# EAGLE design PWM LED Controller (EAGLE 9.6.2)
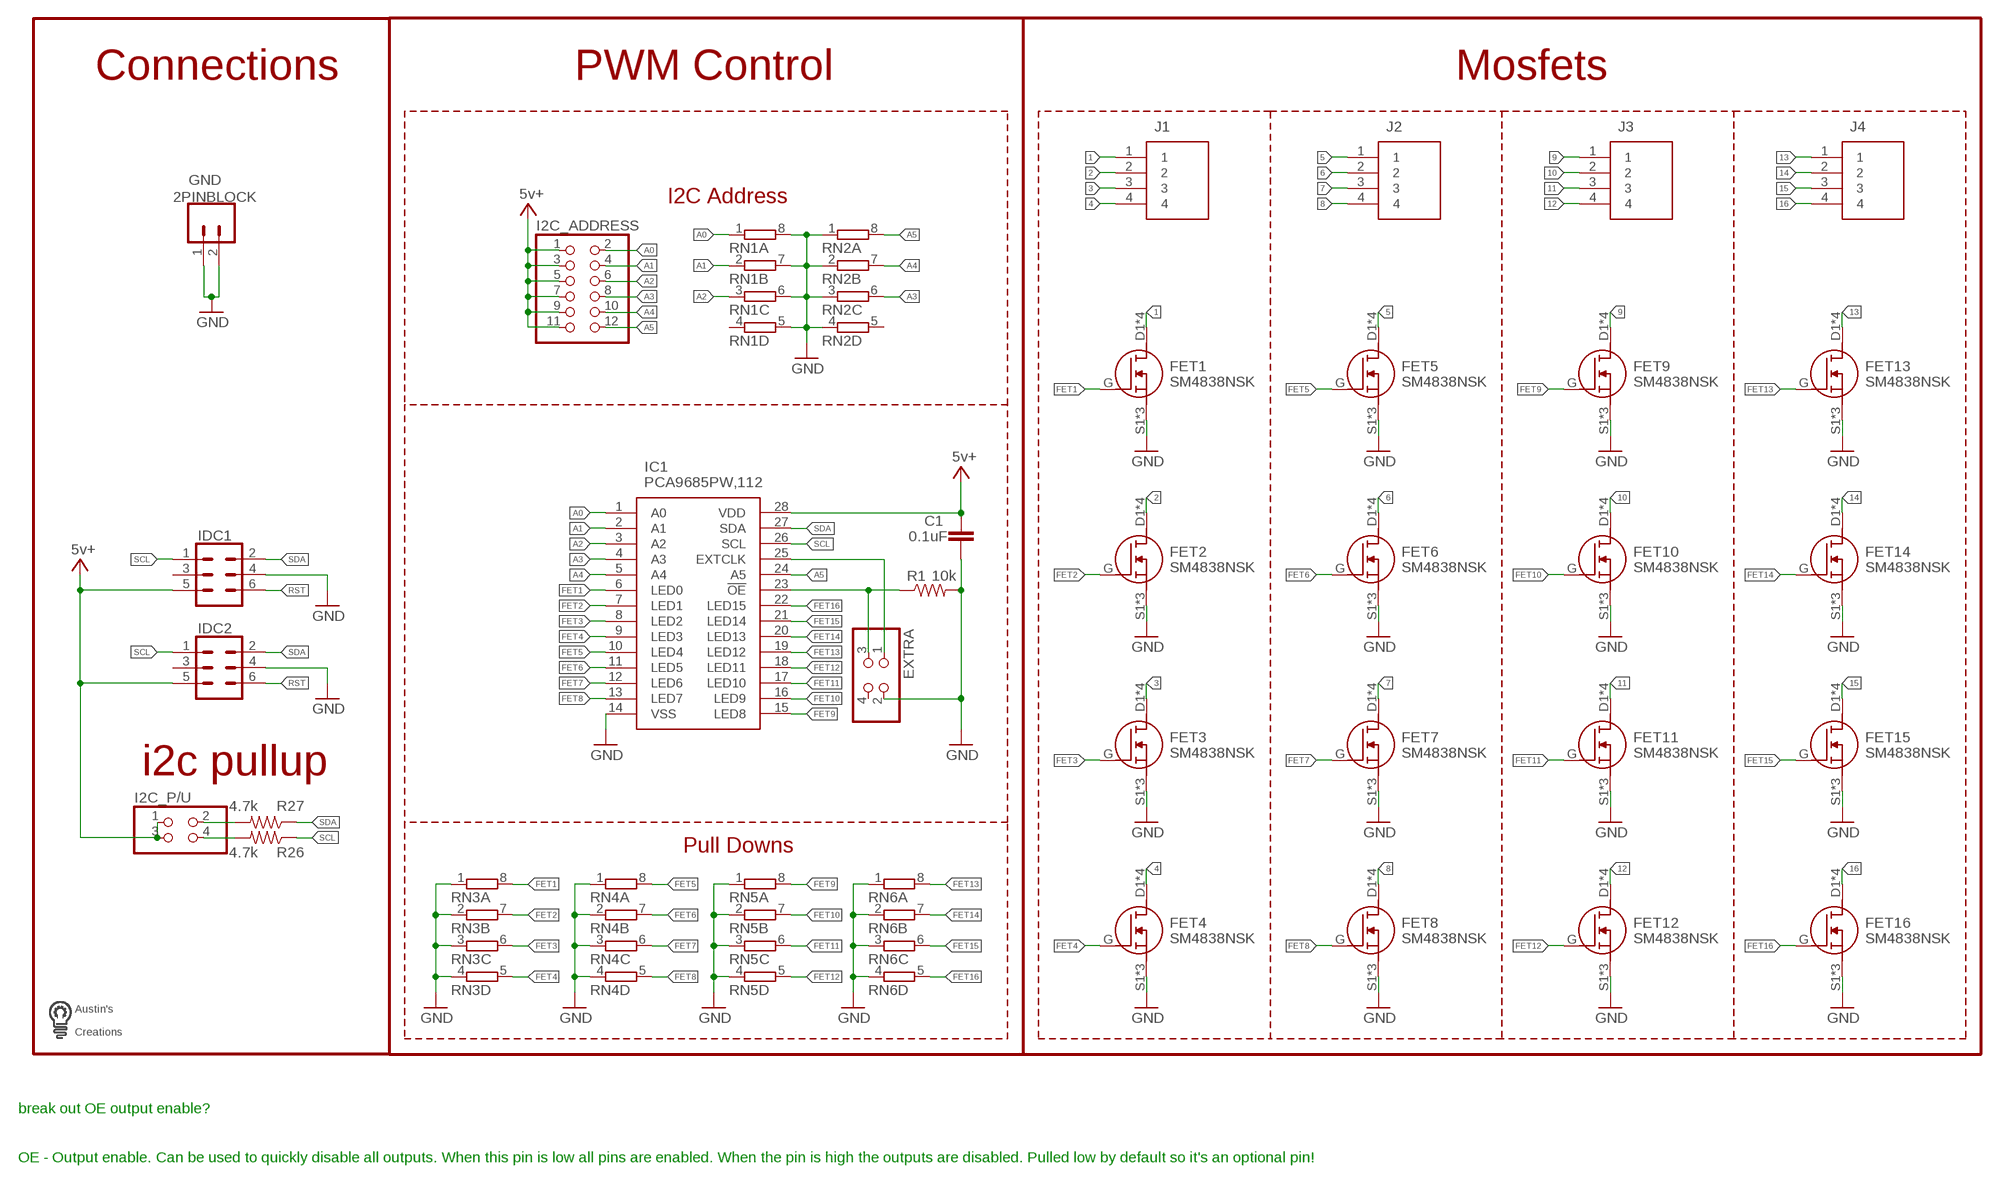
[diagram p0: schematic, sheet 1]

## Parts
C1  0.1uF  C-EUC0603  [C0603]
EXTRA  PINHD-2X2  [2X02]
FET1  SM4838NSK  [SM4838NSK]
FET2  SM4838NSK  [SM4838NSK]
FET3  SM4838NSK  [SM4838NSK]
FET4  SM4838NSK  [SM4838NSK]
FET5  SM4838NSK  [SM4838NSK]
FET6  SM4838NSK  [SM4838NSK]
FET7  SM4838NSK  [SM4838NSK]
FET8  SM4838NSK  [SM4838NSK]
FET9  SM4838NSK  [SM4838NSK]
FET10  SM4838NSK  [SM4838NSK]
FET11  SM4838NSK  [SM4838NSK]
FET12  SM4838NSK  [SM4838NSK]
FET13  SM4838NSK  [SM4838NSK]
FET14  SM4838NSK  [SM4838NSK]
FET15  SM4838NSK  [SM4838NSK]
FET16  SM4838NSK  [SM4838NSK]
GND  2PINBLOCK  [SCREWTERMINAL-5MM-2]
I2C_ADDRESS  PINHD-2X6  [2X06]
I2C_P/U  PINHD-2X2  [2X02]
IC1  PCA9685PW,112  [SOP65P640X110-28N]
IDC1  CONN_03X2SHROUD  [2X3-SHROUDED]
IDC2  CONN_03X2SHROUD  [2X3-SHROUDED]
J1  SCREWTERMINAL-4P-5MM  [SCREWTERMINAL-4P-5MM]
J2  SCREWTERMINAL-4P-5MM  [SCREWTERMINAL-4P-5MM]
J3  SCREWTERMINAL-4P-5MM  [SCREWTERMINAL-4P-5MM]
J4  SCREWTERMINAL-4P-5MM  [SCREWTERMINAL-4P-5MM]
R1  10k  R-US_R0603  [R0603]
R26  4.7k  R-US_R0603  [R0603]
R27  4.7k  R-US_R0603  [R0603]
RN1  4R-N0603-ARC  [0603-ARC]
RN2  4R-N0603-ARC  [0603-ARC]
RN3  4R-N0603-ARC  [0603-ARC]
RN4  4R-N0603-ARC  [0603-ARC]
RN5  4R-N0603-ARC  [0603-ARC]
RN6  4R-N0603-ARC  [0603-ARC]
U$1  LOGOMED  [LOGOMED]

## Nets
1: FET1.D1(D) FET1.D2(D) FET1.D3(D) FET1.D4(D) J1.1
2: FET2.D1(D) FET2.D2(D) FET2.D3(D) FET2.D4(D) J1.2
3: FET3.D1(D) FET3.D2(D) FET3.D3(D) FET3.D4(D) J1.3
4: FET4.D1(D) FET4.D2(D) FET4.D3(D) FET4.D4(D) J1.4
5: FET5.D1(D) FET5.D2(D) FET5.D3(D) FET5.D4(D) J2.1
6: FET6.D1(D) FET6.D2(D) FET6.D3(D) FET6.D4(D) J2.2
7: FET7.D1(D) FET7.D2(D) FET7.D3(D) FET7.D4(D) J2.3
8: FET8.D1(D) FET8.D2(D) FET8.D3(D) FET8.D4(D) J2.4
9: FET9.D1(D) FET9.D2(D) FET9.D3(D) FET9.D4(D) J3.1
10: FET10.D1(D) FET10.D2(D) FET10.D3(D) FET10.D4(D) J3.2
11: FET11.D1(D) FET11.D2(D) FET11.D3(D) FET11.D4(D) J3.3
12: FET12.D1(D) FET12.D2(D) FET12.D3(D) FET12.D4(D) J3.4
13: FET13.D1(D) FET13.D2(D) FET13.D3(D) FET13.D4(D) J4.1
14: FET14.D1(D) FET14.D2(D) FET14.D3(D) FET14.D4(D) J4.2
15: FET15.D1(D) FET15.D2(D) FET15.D3(D) FET15.D4(D) J4.3
16: FET16.D1(D) FET16.D2(D) FET16.D3(D) FET16.D4(D) J4.4
A0: I2C_ADDRESS.2 IC1.1(A0) RN1.1
A1: I2C_ADDRESS.4 IC1.2(A1) RN1.2
A2: I2C_ADDRESS.6 IC1.3(A2) RN1.3
A3: I2C_ADDRESS.8 IC1.4(A3) RN2.6
A4: I2C_ADDRESS.10 IC1.5(A4) RN2.7
A5: I2C_ADDRESS.12 IC1.24(A5) RN2.8
FET1: FET1.G IC1.6(LED0) RN3.8
FET2: FET2.G IC1.7(LED1) RN3.7
FET3: FET3.G IC1.8(LED2) RN3.6
FET4: FET4.G IC1.9(LED3) RN3.5
FET5: FET5.G IC1.10(LED4) RN4.8
FET6: FET6.G IC1.11(LED5) RN4.7
FET7: FET7.G IC1.12(LED6) RN4.6
FET8: FET8.G IC1.13(LED7) RN4.5
FET9: FET9.G IC1.15(LED8) RN5.8
FET10: FET10.G IC1.16(LED9) RN5.7
FET11: FET11.G IC1.17(LED10) RN5.6
FET12: FET12.G IC1.18(LED11) RN5.5
FET13: FET13.G IC1.19(LED12) RN6.8
FET14: FET14.G IC1.20(LED13) RN6.7
FET15: FET15.G IC1.21(LED14) RN6.6
FET16: FET16.G IC1.22(LED15) RN6.5
GND: C1.2 EXTRA.2 FET1.S1(S) FET1.S2(S) FET1.S3(S) FET2.S1(S) FET2.S2(S) FET2.S3(S) FET3.S1(S) FET3.S2(S) FET3.S3(S) FET4.S1(S) FET4.S2(S) FET4.S3(S) FET5.S1(S) FET5.S2(S) FET5.S3(S) FET6.S1(S) FET6.S2(S) FET6.S3(S) FET7.S1(S) FET7.S2(S) FET7.S3(S) FET8.S1(S) FET8.S2(S) FET8.S3(S) FET9.S1(S) FET9.S2(S) FET9.S3(S) FET10.S1(S) FET10.S2(S) FET10.S3(S) FET11.S1(S) FET11.S2(S) FET11.S3(S) FET12.S1(S) FET12.S2(S) FET12.S3(S) FET13.S1(S) FET13.S2(S) FET13.S3(S) FET14.S1(S) FET14.S2(S) FET14.S3(S) FET15.S1(S) FET15.S2(S) FET15.S3(S) FET16.S1(S) FET16.S2(S) FET16.S3(S) GND.1 GND.2 IC1.14(VSS) IDC1.4 IDC2.4 R1.2 RN1.5 RN1.6 RN1.7 RN1.8 RN2.1 RN2.2 RN2.3 RN2.4 RN3.1 RN3.2 RN3.3 RN3.4 RN4.1 RN4.2 RN4.3 RN4.4 RN5.1 RN5.2 RN5.3 RN5.4 RN6.1 RN6.2 RN6.3 RN6.4
N$1: I2C_P/U.4 R26.2
N$2: I2C_P/U.2 R27.2
N$3: EXTRA.1 IC1.25(EXTCLK)
N$4: EXTRA.3 IC1.23(!OE) R1.1
RST: IDC1.6 IDC2.6
SCL: IC1.26(SCL) IDC1.1 IDC2.1 R26.1
SDA: IC1.27(SDA) IDC1.2 IDC2.2 R27.1
VCC: C1.1 I2C_ADDRESS.1 I2C_ADDRESS.3 I2C_ADDRESS.5 I2C_ADDRESS.7 I2C_ADDRESS.9 I2C_ADDRESS.11 I2C_P/U.1 I2C_P/U.3 IC1.28(VDD) IDC1.5 IDC2.5 ; supply symbol labelled 5v+
Unconnected: EXTRA.4 IDC1.3 IDC2.3 RN1.4 RN2.5

## Notes on the sheet
- Connections | PWM Control | Mosfets
- I2C Address
- i2c pullup
- Pull Downs
- break out OE output enable?
  
  
  OE - Output enable. Can be used to quickly disable all outputs. When this pin is low all pins are enabled. When the pin is high the outputs are disabled. Pulled low by default so it's an optional pin!

## Library data of the parts
C1 = rcl:C-EU: CAPACITOR, European symbol; SPICEPREFIX: C
EXTRA I2C_P/U = pinhead:PINHD-2X2: PIN HEADER
FET1-FET16 = custom parts:SM4838NSK: N channel mosfet 30v 10a SOP-8
GND = custom parts:2PINBLOCK
I2C_ADDRESS = pinhead:PINHD-2X6: PIN HEADER
IC1 = SamacSys_Parts:PCA9685PW,112: 16-channel, 12-bit PWM Fm+ I2C-bus LED controller Source: Datasheet <http://www.nxp.com/docs/en/data-sheet/PCA9685.pdf>; ARROW_PART_NUMBER: PCA9685PW,112; ARROW_PRICE-STOCK: https://www.arrow.com/en/products/pca9685pw112/nxp-semiconductors; DESCRIPTION: 16-channel, 12-bit PWM Fm+ I2C-bus LED controller; HEIGHT: 1.1mm; MANUFACTURER_NAME: NXP; MANUFACTURER_PART_NUMBER: PCA9685PW,112; MOUSER_PART_NUMBER: 771-PCA9685PW,112; MOUSER_PRICE-STOCK: https://www.mouser.co.uk/ProductDetail/NXP-Semiconductors/PCA9685PW112?qs=6YAT8rHPFU9wZqiAeiOMZw%3D%3D
IDC1 IDC2 = custom parts:CONN_03X2: Multi connection point. Often used as Generic Header-pin footprint for 0.1 inch spaced/style header connections You can populate with any combo of single row headers, but if you'd like an exact match, check these: Header - 2x3 (Male, 0.1") <https://www.sparkfun.com/products/12807> (PRT-12807) Header - 2x3 (Female, 0.1") <https://www.sparkfun.com/products/13010> (PRT-13010) 2x3 Pin Shrouded Header <https://www.sparkfun.com/products/10877> (PRT-10877) On any of the 0.1 inch spaced packages, you can populate with these: Break Away Headers - Straight <https://www.sparkfun.com/products/116> (PRT-00116) Break Away Male Headers - Right Angle <https://www.sparkfun.com/products/553> (PRT-00553) Female Headers <https://www.sparkfun.com/products/115> (PRT-00115) Break Away Headers - Machine Pin <https://www.sparkfun.com/products/117> (PRT-00117) Break Away Female Headers - Swiss Machine Pin <https://www.sparkfun.com/products/743> (PRT-00743) Special note: the shrouded connector mates well with our 3x2 ribbon cables: Ribbon Crimp Connector - 6-pin (2x3, Female) <https://www.sparkfun.com/products/10651> (PRT-10651) Ribbon Cable - 6 wire (15ft) <https://www.sparkfun.com/products/10646> (PRT-10646); PROD_ID: CONN-10681; SF_ID: PRT_10877
J1-J4 = SamacSys_Parts:SCREWTERMINAL-4P-5MM: Fixed Terminal Blocks Terminal block, screw type, 5.00, horizontal, 4 poles, CUI Blue, slotted screw, PCB mount Source: Datasheet <https://componentsearchengine.com/Datasheets/1/TB001-500-04BE.pdf>; DESCRIPTION: Fixed Terminal Blocks Terminal block, screw type, 5.00, horizontal, 4 poles, CUI Blue, slotted screw, PCB mount; HEIGHT: 12.9mm; MANUFACTURER_NAME: CUI Inc.; MANUFACTURER_PART_NUMBER: TB001-500-04BE; MOUSER_PART_NUMBER: 490-TB001-500-04BE; MOUSER_PRICE-STOCK: https://www.mouser.co.uk/ProductDetail/CUI-Devices/TB001-500-04BE?qs=vLWxofP3U2xFd1xqNcHXZA%3D%3D
R1 R26 R27 = rcl:R-US_: RESISTOR, American symbol; SPICEPREFIX: R
RN1-RN6 = custom parts:4R-N: Array Chip Resistor Source: RS Component / Phycomp; OC_FARNELL: unknown; OC_NEWARK: unknown
U$1 = custom parts:LOGOMED

## Board
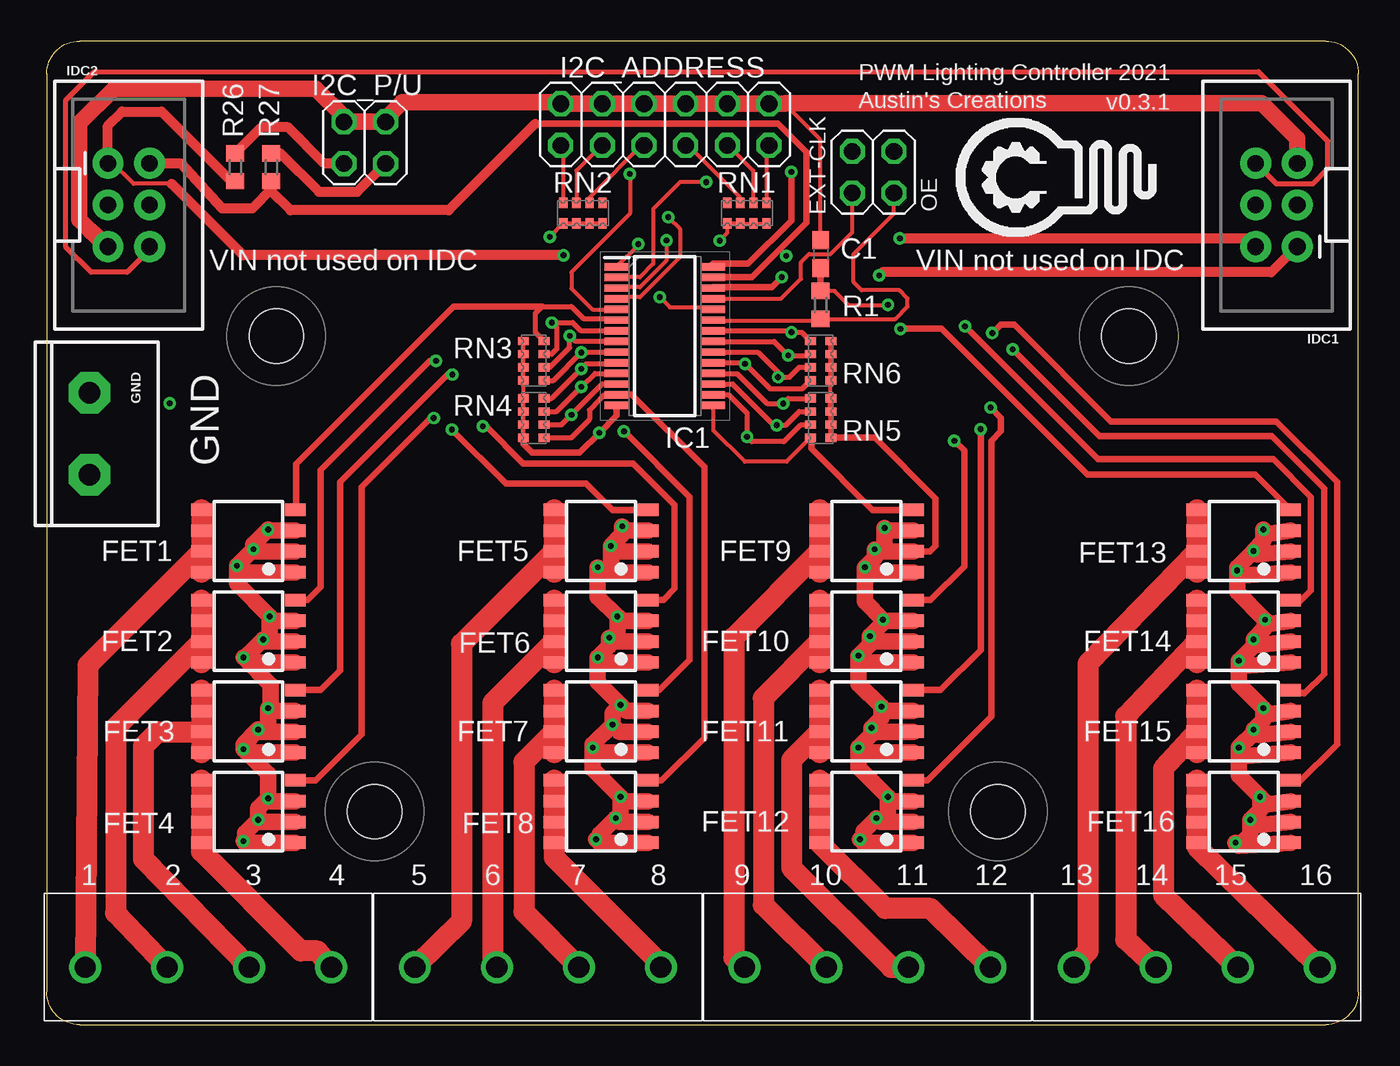
[diagram p1: board, top side]
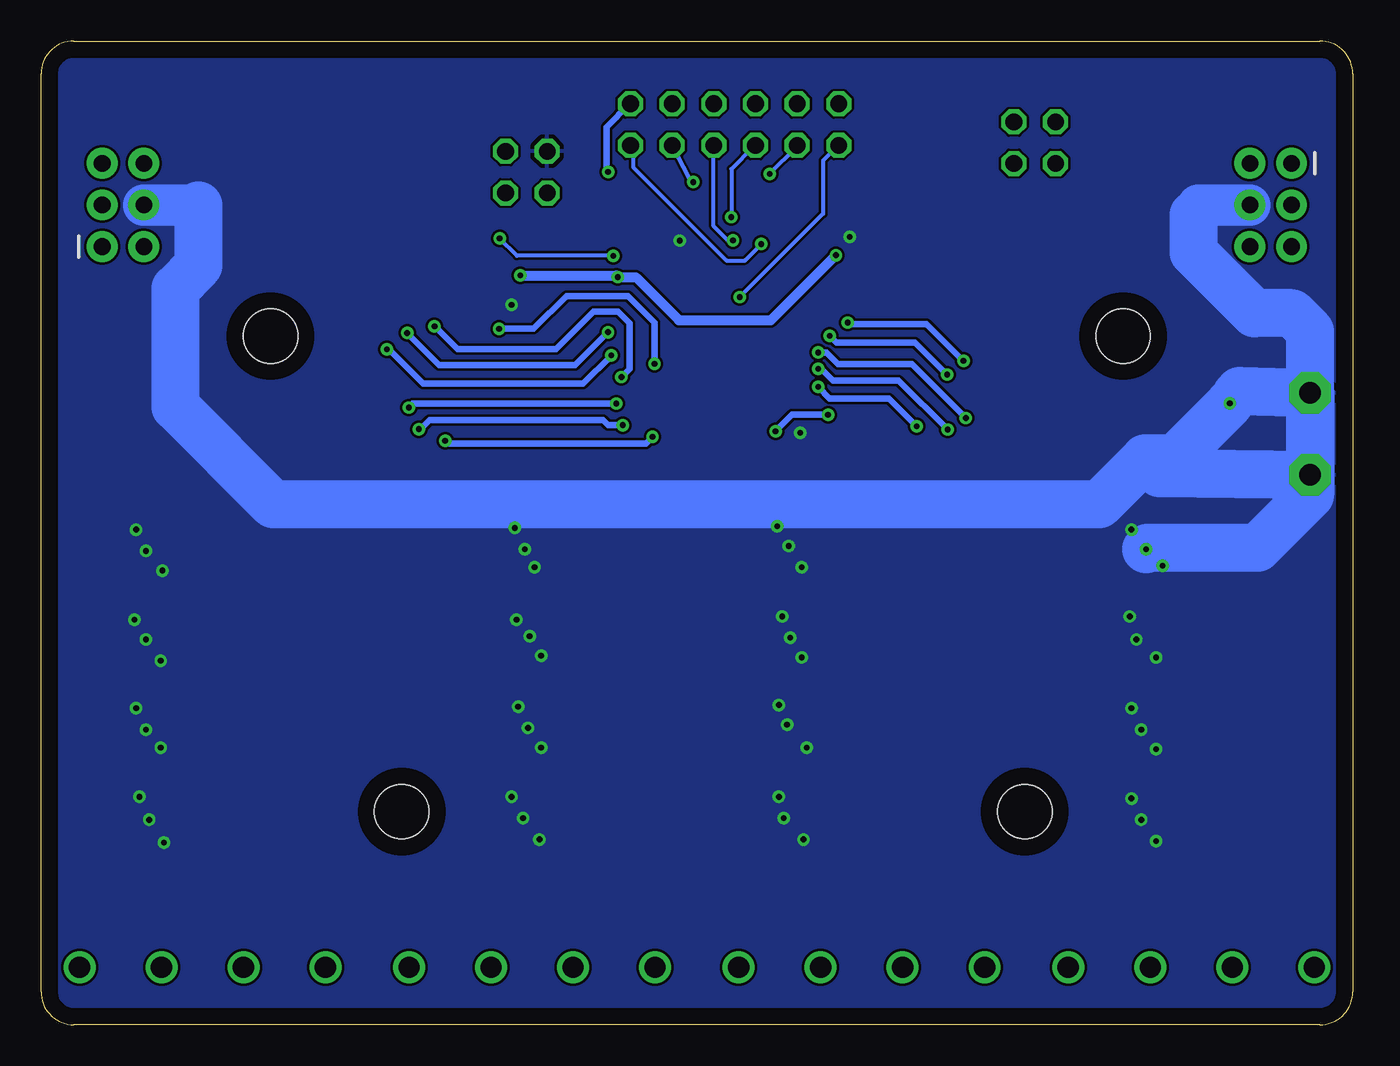
[diagram p2: board, bottom side, seen from below]

Size 80 x 60 mm. Coordinates in mm from the lower left corner, seen from the top.
Outline: 2,0 78,0 arc90 80,2 80,58 arc90 78,60 2,60 arc90 0,58 0,2 arc90 2,0
Copper layers (1*16): Top 0.035mm / dielectric 1.5mm / Bottom 0.035mm
Design rules "default *": minimum track width 10mil, minimum drill 0.35mm, track to track 6mil, track to pad 6mil, pad to pad 6mil, via to via 6mil, smd to smd 6mil, copper to edge 40mil, drill to drill 6mil, minimum pad ring 10mil, minimum via ring 8mil, stop-mask expansion 4mil, vias tented up to drill 0mil, thermal gap 10mil
Holes 3.3 mm at 20,13 58,13 14,42 66,42

### Footprints (pad centres in the part's own frame; a part is rotated, then mirrored left to right if it is on the bottom)
C0603 = smd 1.1 x 1: 1 -0.85,0; 2 0.85,0
2X02 = drill 1.016 octagon: 1 -1.27,-1.27; 2 -1.27,1.27; 3 1.27,-1.27; 4 1.27,1.27
SM4838NSK = smd 0.76 x 1.27: D1 -1.905,2.86; D2 -0.635,2.86; D3 0.635,2.86; D4 1.905,2.86; G 1.905,-2.86; S1 -1.905,-2.86; S2 -0.635,-2.86; S3 0.635,-2.86
SCREWTERMINAL-5MM-2 = drill 1.3 pad 2.54 octagon: 1 -2.54,0; 2 2.46,0
2X06 = drill 1.016 octagon: 1 -6.35,-1.27; 2 -6.35,1.27; 3 -3.81,-1.27; 4 -3.81,1.27; 5 -1.27,-1.27; 6 -1.27,1.27; 7 1.27,-1.27; 8 1.27,1.27; 9 3.81,-1.27; 10 3.81,1.27; 11 6.35,-1.27; 12 6.35,1.27
SOP65P640X110-28N = smd 1.475 x 0.45: 1 -2.938,4.225; 2 -2.938,3.575; 3 -2.938,2.925; 4 -2.938,2.275; 5 -2.938,1.625; 6 -2.938,0.975; 7 -2.938,0.325; 8 -2.938,-0.325; 9 -2.938,-0.975; 10 -2.938,-1.625; 11 -2.938,-2.275; 12 -2.938,-2.925; 13 -2.938,-3.575; 14 -2.938,-4.225; 15 2.938,-4.225; 16 2.938,-3.575; 17 2.938,-2.925; 18 2.938,-2.275; 19 2.938,-1.625; 20 2.938,-0.975; 21 2.938,-0.325; 22 2.938,0.325; 23 2.938,0.975; 24 2.938,1.625; 25 2.938,2.275; 26 2.938,2.925; 27 2.938,3.575; 28 2.938,4.225
2X3-SHROUDED = drill 1.016 pad 1.88: 1 -1.27,2.54; 2 1.27,2.54; 3 -1.27,0; 4 1.27,0; 5 -1.27,-2.54; 6 1.27,-2.54
SCREWTERMINAL-4P-5MM = drill 1.3 pad 1.95: 1 0,0; 2 5,0; 3 10,0; 4 15,0
R0603 = smd 1 x 1.1: 1 -0.85,0; 2 0.85,0
0603-ARC = smd 0.5 x 0.65: 1 -1.2,-0.625; 2 -0.4,-0.625; 3 0.4,-0.625; 4 1.2,-0.625; 5 1.2,0.625; 6 0.4,0.625; 7 -0.4,0.625; 8 -1.2,0.625

### Placement (x,y rotation side)
C1  47.2,47 270 top
EXTRA  50.4,52 0 top
FET1  12.3,29.5 90 top
FET2  12.3,24 90 top
FET3  12.3,18.5 90 top
FET4  12.3,13 90 top
FET5  33.8,29.5 90 top
FET6  33.8,24 90 top
FET7  33.8,18.5 90 top
FET8  33.8,13 90 top
FET9  50,29.5 90 top
FET10  50,24 90 top
FET11  50,18.5 90 top
FET12  50,13 90 top
FET13  73,29.5 90 top
FET14  73,24 90 top
FET15  73,18.5 90 top
FET16  73,13 90 top
GND  2.6,36 270 top
I2C_ADDRESS  37.7,54.9 180 top
I2C_P/U  19.4,53.8 180 top
IC1  37.7,42 0 top
IDC1  75,50 180 top
IDC2  5,50 0 top
J1  2.35,3.5 0 top
J2  22.45,3.5 0 top
J3  42.55,3.5 0 top
J4  62.65,3.5 0 top
R1  47.2,43.9 90 top
R26  11.5,52.3 90 top
R27  13.7,52.3 90 top
RN1  42.7,49.5 180 top
RN2  32.7,49.5 0 top
RN3  29.7,40.5 270 top
RN4  29.7,37 270 top
RN5  47.2,37 90 top
RN6  47.2,40.5 90 top
U$1  68,47.4 90 top

### Tracks (layer width: path | path; a pad name or v marks a point on that pad's centre or on a via)
1
  Top 1.27: FET1.D4 FET1.D3 FET1.D2 | FET1.D2 FET1.D1 | FET1.D2 2.5,21.93 J1.1
2
  Top 1.27: FET2.D4 FET2.D3 FET2.D2 | FET2.D2 FET2.D1 | FET2.D2 4.2,18.12 4.2,6.8 J1.2
3
  Top 1.27: FET3.D4 FET3.D3 FET3.D2 | FET3.D2 FET3.D1 | J1.3 5.9,10.1 5.9,17 6.76,17.86 FET3.D2
4
  Top 1.27: FET4.D4 FET4.D3 FET4.D2 FET4.D1 9.44,10.56 15.5,4.5 16.5,4.5 J1.4
5
  Top 1.27: FET5.D4 FET5.D3 FET5.D2 | FET5.D2 FET5.D1 | FET5.D2 25.3,23.23 25.3,6.3 J2.1
6
  Top 1.27: FET6.D4 FET6.D3 FET6.D2 | FET6.D2 FET6.D1 | FET6.D2 27.2,19.62 27.2,3.8 J2.2
7
  Top 1.27: FET7.D4 FET7.D3 FET7.D2 | FET7.D2 FET7.D1 | FET7.D2 29.1,16.02 29.1,6.9 J2.3
8
  Top 1.27: FET8.D4 FET8.D3 FET8.D2 FET8.D1 30.94,10.2 37.49,3.65 37.42,3.58 J2.4
9
  Top 1.27: FET9.D4 FET9.D3 FET9.D2 | FET9.D2 FET9.D1 | FET9.D2 41.9,23.62 41.9,4.1 J3.1
10
  Top 1.27: FET10.D4 FET10.D3 FET10.D2 | FET10.D2 FET10.D1 | FET10.D2 43.7,19.93 43.7,7.3 J3.2
11
  Top 1.27: FET11.D4 FET11.D3 FET11.D2 | FET11.D2 FET11.D1 | FET11.D2 45.42,16.15 45.42,9.58 51.5,3.5 J3.3
12
  Top 1.27: FET12.D4 FET12.D3 FET12.D2 FET12.D1 51.14,7.09 53.91,7.09 J3.4
13
  Top 1.27: FET13.D4 FET13.D3 FET13.D2 | FET13.D2 FET13.D1 | FET13.D2 63.5,22.02 63.5,4.5 J4.1
14
  Top 1.27: FET14.D4 FET14.D3 FET14.D2 | FET14.D2 FET14.D1 | FET14.D2 65.8,18.82 65.8,5.2 J4.2
15
  Top 1.27: FET15.D4 FET15.D3 FET15.D2 | FET15.D2 FET15.D1 | FET15.D2 68.1,15.62 68.1,7.9 J4.3
16
  Top 1.27: FET16.D4 FET16.D3 FET16.D2 FET16.D1 70.14,10.86 J4.4
A0  (via drill 0.35)
  Top 0.254: RN1.1 43.89,50.27 43.89,53.52 I2C_ADDRESS.2 | v36.07,47.61 36.07,47.53 IC1.1
  Bottom 0.254: v36.07,47.61 37.07,46.61 38.19,46.61 43.89,52.31 43.89,53.52 I2C_ADDRESS.2
A1  (via drill 0.35)
  Top 0.254: RN1.2 43.08,50.27 43.08,52.1 41.66,53.52 I2C_ADDRESS.4 | v40.23,51.4 38.63,51.4 36.98,49.75 36.98,46.41 36.17,45.6 34.95,45.6 IC1.2
  Bottom 0.254: v40.23,51.4 40.45,51.62 I2C_ADDRESS.4
A2  (via drill 0.35)
  Top 0.254: RN1.3 42.27,50.27 42.27,50.47 39.01,53.73 I2C_ADDRESS.6 | v37.8,47.83 37.8,46.61 36.17,44.99 34.95,44.99 IC1.3
  Bottom 0.254: v37.8,47.83 38.09,47.83 39.01,48.75 39.01,53.52 I2C_ADDRESS.6
A3  (via drill 0.35)
  Top 0.254: RN2.6 33.12,50.27 33.12,50.47 36.37,53.73 I2C_ADDRESS.8 | v37.9,49.25 38.61,48.55 38.61,46.82 36.17,44.38 34.95,44.38 IC1.4
  Bottom 0.254: v37.9,49.25 37.9,52.2 36.58,53.52 I2C_ADDRESS.8
A4  (via drill 0.35)
  Top 0.254: RN2.7 32.31,50.27 32.31,52.1 33.73,53.52 I2C_ADDRESS.10 | v35.56,51.9 35.56,49.46 32,45.9 32,44.9 33.27,43.62 IC1.5
  Bottom 0.254: v35.56,51.9 33.93,53.52 I2C_ADDRESS.10
A5  (via drill 0.35)
  Top 0.254: RN2.8 31.5,50.27 31.5,53.52 I2C_ADDRESS.12 | v37.39,44.38 38,43.77 40.44,43.77 IC1.24
  Bottom 0.254: v37.39,44.38 32.31,49.46 32.31,52.71 31.5,53.52 I2C_ADDRESS.12
FET1
  Top 0.254: 34.68,43.05 IC1.6
  Top 0.305: 34.68,43.05 32.74,43.05 32,43.8 30.2,43.8 29.8,43.4 29.8,42.23 RN3.8
  Top 0.406: FET1.G 15.2,31.45 15.2,34.2 24.8,43.8 30.2,43.8
FET2  (via drill 0.35)
  Top 0.254: 34.75,42.35 IC1.7
  Top 0.305: RN3.7 30.8,40.9 31.1,41.2 31.1,42.52 v30.8,42.83 32.07,42.83 32.55,42.35 34.75,42.35
  Top 0.406: v23.74,40.49 23.34,40.49 16.7,33.85 16.7,26.7 15.9,25.91 FET2.G
  Bottom 0.406: v30.8,42.83 30.7,42.73 26,42.73 23.76,40.49 v23.74,40.49
FET3  (via drill 0.35)
  Top 0.254: 34.76,41.63 IC1.8
  Top 0.305: RN3.6 30.7,40.1 31.9,41.3 v31.9,42.01 32.21,41.7 34.69,41.7 34.76,41.63
  Top 0.406: v24.74,39.66 24.44,39.66 17.9,33.11 17.9,21.6 16.7,20.41 FET3.G
  Bottom 0.406: v31.9,42.01 31.5,41.61 26.7,41.61 v24.74,39.66
FET4  (via drill 0.35)
  Top 0.305: IC1.9 32.62,41.02 v32.6,41 30.9,39.3 RN3.5
  Top 0.406: v23.6,37 23.4,37 19.2,32.8 19.2,17.7 16.41,14.9 FET4.G
  Bottom 0.406: v23.6,37 26.9,40.3 31.4,40.3 32.1,41 v32.6,41
FET5  (via drill 0.35)
  Top 0.254: 34.75,40.31 IC1.10
  Top 0.305: RN4.8 30.8,38.2 v32.6,40 32.91,40.31 34.75,40.31
  Top 0.406: v24.7,36.3 28,33 32.9,33 34.49,31.41 FET5.G
  Bottom 0.406: v24.7,36.3 27.7,39.3 31.7,39.3 32.4,40 v32.6,40
FET6  (via drill 0.35)
  Top 0.305: IC1.11 33.42,39.73 v32.6,38.9 31.1,37.4 RN4.7
  Top 0.406: v26.6,36.5 26.8,36.5 29.06,34.24 35.74,34.24 38.3,31.68 38.3,26.6 37.6,25.91 FET6.G
  Bottom 0.406: v26.6,36.5 28.3,38.2 31.9,38.2 v32.6,38.9
FET7  (via drill 0.35)
  Top 0.305: IC1.12 33.88,39.08 v32,37.2 31.4,36.6 RN4.6
  Top 0.406: v35.2,36.2 39.2,32.2 39.2,22.25 37.36,20.41 FET7.G
  Bottom 0.406: v35.2,36.2 34.2,37.2 v32,37.2
FET8
  Top 0.305: IC1.13 34.74,38.41 34,38.41 33.72,38.13 33.72,38.12 33.1,37.5 33.1,36.9 32,35.8 RN4.5
  Top 0.406: IC1.13 35.67,38.42 40.1,34 40.1,17.5 37.51,14.9 FET8.G
FET9
  Top 0.254: IC1.15 40.64,36.28 42.58,34.34 45.12,34.34 RN5.8 46.64,35.74
  Top 0.406: 46.64,35.74 46.64,35.14 50.37,31.41 FET9.G
FET10  (via drill 0.35)
  Top 0.305: RN5.7 46,36.6 44.96,35.56 43.01,35.56 v42.71,35.86 42.71,37.29 41.58,38.42 IC1.16
  Top 0.406: v55.35,35.61 55.95,35.01 55.95,27.95 53.91,25.91 FET10.G
  Bottom 0.406: v55.35,35.61 55.2,35.46 43.11,35.46 v42.71,35.86
FET11  (via drill 0.35)
  Top 0.305: IC1.17 41.83,39.08 44.33,36.57 v44.52,36.57 45.07,36.57 45.9,37.4 RN5.6
  Top 0.406: v56.96,36.33 56.96,22.86 54.51,20.41 FET11.G
  Bottom 0.406: v56.96,36.33 56.84,36.33 56.3,36.87 45.72,36.87 45.42,36.57 v44.52,36.57
FET12  (via drill 0.35)
  Top 0.305: IC1.18 40.66,39.7 42.1,39.7 43.91,37.89 v44.92,37.89 45.23,38.2 RN5.5
  Top 0.406: v57.57,37.64 58.2,37.01 58.2,36.2 57.6,35.6 57.6,18.8 53.7,14.9 FET12.G
  Bottom 0.406: v57.57,37.64 57.32,37.89 v44.92,37.89
FET13  (via drill 0.35)
  Top 0.305: FET13.G | IC1.19 42.52,40.38 v42.59,40.31 44.1,38.8 46.08,38.8 RN6.8
  Top 0.406: FET13.G 73.72,33.55 63.46,33.55 54.56,42.45 v52.06,42.45
  Bottom 0.406: v52.06,42.45 49.96,42.45 47.96,44.45 44.21,44.45 42.59,42.82 v42.59,40.31
FET14  (via drill 0.35)
  Top 0.305: IC1.20 43.38,41.02 44.6,39.8 v44.6,39.5 45.3,39.5 45.9,40.1 RN6.7
  Top 0.406: v56,42.6 64.1,34.5 74.8,34.5 77.1,32.2 77.1,26.5 76.31,25.7 FET14.G
  Bottom 0.406: v44.6,39.5 44.1,40 44.1,42.8 44.8,43.5 46.3,43.5 48.6,41.2 54.6,41.2 v56,42.6
FET15  (via drill 0.35)
  Top 0.305: RN6.6 46.5,40.82 v45.22,40.82 44.37,41.67 IC1.21
  Top 0.406: FET15.G 76.7,20.2 77.9,21.4 77.9,32.7 74.7,35.9 64.2,35.9 v58.9,41.2
  Bottom 0.406: v45.22,40.82 46.94,39.1 56.7,39.1 58.8,41.2 v58.9,41.2
FET16  (via drill 0.35)
  Top 0.305: IC1.22 45.33,42.33 v45.42,42.24 46.04,42.24 RN6.5
  Top 0.406: FET16.G 76.31,14.71 78.7,17.1 78.7,33.1 75,36.8 64.9,36.8 59,42.7 58.18,42.7 v57.67,42.19
  Bottom 0.406: v57.67,42.19 55.72,40.24 47.42,40.24 v45.42,42.24
GND  (via drill 0.35)
  Top 0.254: 47.14,44.78 R1.2 48.05,44.75 48.9,43.9 v51.3,43.9 | RN1.8 43.89,48.85 43.28,48.85 RN1.7 43.08,48.85 42.47,48.85 RN1.6 42.27,48.85 41.66,48.85 RN1.5 41.5,48.29 v41.04,47.83 | RN5.1 47.75,35.84 47.75,36.45 RN5.2 47.75,36.66 47.75,37.27 RN5.3 47.75,37.47 | 47.75,38.08 RN5.4 47.75,38.28 47.75,39.3 RN6.1 47.75,39.5 47.75,39.91 RN6.2 47.75,40.11 47.75,40.72 RN6.3 47.75,40.92 47.75,41.53 RN6.4 | RN3.1 29.06,41.53 29.06,40.92 RN3.2 29.06,40.72 29.06,40.11 RN3.3 29.06,39.91 29.06,39.5 RN3.4 29.06,39.3 29.06,38.28 RN4.1 29.06,38.08 29.06,37.47 RN4.2 29.06,37.27 29.06,36.66 RN4.3 29.06,36.45 29.06,35.84 RN4.4 29.26,35.64 | RN2.4 33.73,48.85 33.12,48.85 RN2.3 32.92,48.85 32.31,48.85 RN2.2 32.11,48.85 31.7,48.85 RN2.1 30.78,48.15 30.76,48.05 v30.68,48.05 | 34.95,37.67 IC1.14 | 37.14,30.32 FET5.S3 | 34.91,30.73 v35.1,30.4 | 53.24,30.32 FET9.S3
  Top 0.305: 47.75,38.08 47.75,37.47
  Top 0.406: RN5.1 50.5,35.8 54.2,32.1 54.2,29.2 53.87,28.86 FET9.S2 | RN4.4 29.07,35.42 29.6,34.9 32.5,34.9 v33.7,36.1 34.76,37.16 IC1.14 | C1.2 47.2,44.84 47.14,44.78
  Top 1.016: FET1.S3 13.56,30.14 v13.5,30.2 12.6,29.3 v12.6,29 | FET1.S2 12.73,28.86 v12.6,29 | FET1.S1 12.01,27.59 v11.6,28 | FET4.S1 12.11,11.1 | 12.11,11.1 v12,11.2 | FET4.S2 13.04,12.37 v12.9,12.5 | FET4.S3 13.66,13.63 v13.5,13.8 | FET3.S1 12.21,16.59 v12,16.8 | FET3.S2 13.04,17.86 | 13.04,17.86 v12.9,18 12,17.1 v12,16.8 | FET3.S3 13.66,19.14 | 13.66,19.14 v13.5,19.3 13.5,18.33 13.04,17.86 | FET2.S1 12.3,22.09 | 12.3,22.09 v12,22.4 13.66,20.73 13.66,19.14 | FET2.S2 13.34,23.36 | 13.34,23.36 v13.2,23.5 12.3,22.61 12.3,22.09 | FET2.S3 13.87,24.64 v13.6,24.9 | FET8.S1 33.7,11.1 | 33.7,11.1 v33.5,11.3 | FET8.S2 34.94,12.37 | 34.94,12.37 v34.7,12.6 33.7,11.61 33.7,11.1 | FET8.S3 35.27,13.63 v35,13.9 | FET7.S1 33.6,16.59 v33.3,16.9 | FET7.S2 34.94,17.86 v34.5,18.3 | FET7.S3 35.37,19.14 v35,19.5 | FET6.S1 33.91,22.09 v33.6,22.4 | FET6.S2 34.53,23.36 | 34.53,23.36 v34.3,23.6 34.3,23.1 v33.6,22.4 | FET6.S3 35.06,24.64 v34.8,24.9 | FET5.S1 33.91,27.59 | 33.91,27.59 v33.6,27.9 33.6,26.1 v34.8,24.9 | FET5.S2 34.73,28.86 v34.4,29.2 | FET5.S3 35.37,30.14 v35.1,30.4 35.1,29.9 v34.4,29.2 | FET12.S1 49.8,11.1 | 49.8,11.1 v49.6,11.3 | FET12.S2 50.84,12.37 | 50.84,12.37 v50.6,12.6 49.8,11.8 49.8,11.1 | FET12.S3 51.56,13.63 v51.3,13.9 | FET11.S1 49.8,16.59 v49.5,16.9 | FET11.S2 50.53,17.86 v50.3,18.1 | FET11.S3 51.16,19.14 v50.9,19.4 | FET10.S1 49.91,22.09 v49.5,22.5 | FET10.S2 50.53,23.36 v50.2,23.7 | FET10.S3 51.06,24.64 v51,24.7 | FET9.S1 50.2,27.59 v49.9,27.9 | FET9.S2 50.63,28.86 | 50.63,28.86 v50.5,29 50.5,28.5 v49.9,27.9 | FET9.S3 51.27,30.14 v51.1,30.3 51.1,29.33 50.63,28.86 | FET16.S1 72.7,10.89 | 72.7,10.89 v72.5,11.1 | FET16.S2 73.73,12.16 v73.4,12.5
  Top 1.016: FET16.S3 74.47,13.44 v74,13.9 | FET15.S1 73.2,16.39 v72.7,16.9 | FET15.S2 73.94,17.66 v73.6,18 | FET15.S3 74.56,18.93 v74.2,19.3 | FET14.S1 73,21.89 v72.7,22.2 | FET14.S2 73.94,23.16 v73.6,23.5 | FET14.S3 74.56,24.43 v74.3,24.7 | FET13.S1 72.91,27.39 v72.6,27.7 | FET13.S2 73.83,28.66 v73.6,28.9 | FET13.S3 74.47,29.93 v74.2,30.2 74.2,29.5 v73.6,28.9 | v73.6,28.9 72.6,27.9 v72.6,27.7 | v74.3,24.7 74.3,24.2 v73.6,23.5 | v73.6,23.5 73.6,23.1 v72.7,22.2 | v74.2,19.3 74.2,18.6 v73.6,18 | v73.6,18 73.6,17.8 v72.7,16.9 | v74,13.9 74,13.1 v73.4,12.5 | v73.4,12.5 73.4,11.59 72.7,10.89 | v51.3,13.9 51.3,12.83 50.84,12.37 | v50.3,18.1 50.3,17.7 v49.5,16.9 | v50.9,19.4 50.9,18.7 v50.3,18.1 | v50.2,23.7 50.2,23.2 v49.5,22.5 | v51,24.7 51,24.5 v50.2,23.7 | v49.9,27.9 49.9,25.8 v51,24.7 | v49.5,22.5 49.5,20.8 v50.9,19.4 | v49.5,16.9 49.5,15.7 v51.3,13.9 | v72.6,27.7 72.6,26.4 v74.3,24.7 | v72.7,22.2 72.7,20.8 v74.2,19.3 | v72.7,16.9 72.7,15.2 v74,13.9 | v34.4,29.2 34.4,28.09 33.91,27.59 | v34.8,24.9 34.8,23.63 34.53,23.36 | v33.6,22.4 33.6,20.9 v35,19.5 | v35,19.5 34.5,19 v34.5,18.3 | v34.5,18.3 33.3,17.1 v33.3,16.9 | v33.3,16.9 33.3,15.6 v35,13.9 | v35,13.9 35,12.43 34.94,12.37 | v12.6,29 v11.6,28 | v11.6,28 11.6,26.9 v13.6,24.9 | v13.6,24.9 13.6,23.63 13.34,23.36 | v12,16.8 13.5,15.3 v13.5,13.8 | v13.5,13.8 12.9,13.2 v12.9,12.5 | v12.9,12.5 12.11,11.71 12.11,11.1
  Bottom 2.54: 70.4,49.96 70.26,50 IDC1.4 | IDC2.4 9.43,50 9.22,49.88 9.7,49.4
  Bottom 2.921: 6.9,38.64 7.1,38.44 | 12.66,34.54 15.46,31.74 65.84,31.74 71.8,37.7 71.8,44.9 70.4,46.3 70.4,49.96 | 11.76,33.64 10.86,34.54 v7.5,37.9 | GND.1 2.6,42.3 3.7,43.4 6,43.4 9.7,47.1 9.7,49.4 | GND.2 2.6,32.3 5.8,29.1 12.5,29.1 v12.6,29
  Bottom 2.95: 6.9,38.64 GND.1 GND.2 11.76,33.64 | 10.86,34.54 12.66,34.54
  pour Bottom: 0,0 0,60 80,60 80,0
N$1
  Top 0.61: I2C_P/U.4 16.93,52.53 14.73,54.73 13.08,54.73 R26.2
N$2
  Top 0.61: R27.2 14.25,53.15 16.6,50.8 18.94,50.8 I2C_P/U.2
N$3
  Top 0.254: IC1.25 44.77,44.27 46,45.5 46,46.5 46.5,47 47.8,47 49.13,48.33 EXTRA.1
N$4
  Top 0.254: IC1.23 40.64,42.95 47.14,42.95 R1.1 51.75,43.05 52.5,43.8 52.5,44.3 52,44.8 49.7,44.8 49.2,45.3 49.2,47 51.67,49.47 EXTRA.3
RST
  Top 0.305: IDC2.6 6.27,47.27 4.9,45.9 2.7,45.9 1.17,47.43 1.17,56.4 2.9,58.13 73.9,58.13 78.13,53.9 78.13,52.2 77.23,51.3 74.97,51.3 IDC1.6
SCL  (via drill 0.35)
  Top 0.254: 40.64,44.99 IC1.26 | 7.62,51.29 5.29,51.29 3.97,52.6 3.74,52.6 IDC2.1
  Top 0.406: 40.64,44.99 44.22,44.99 v44.83,45.6
  Top 0.61: IDC2.1 3.73,54.83 4.6,55.7 7,55.7 11.2,51.5 11.45,51.5 R26.1 | v50.76,45.7 50.96,45.9 74.68,45.9 76.27,47.49 IDC1.1 | 7.62,51.29 11.97,46.93 v31.52,46.93
  Bottom 0.254: 44.93,45.7 v44.83,45.6
  Bottom 0.61: v50.76,45.7 44.93,45.7 | v31.52,46.93 35.49,42.97 41.09,42.97 43.73,45.6 v44.83,45.6
SDA  (via drill 0.35)
  Top 0.254: 40.64,45.6 IC1.27 | v45.1,46.9 44.81,47.19 44.61,47.19
  Top 0.406: 40.64,45.6 43.01,45.6 44.61,47.19 46.33,48.92 46.33,53.21 44.6,54.94 29.79,54.94
  Top 0.61: IDC2.2 8.17,52.54 10.68,49.8 12.55,49.8 13.7,50.95 R27.1 13.7,50.85 14.87,49.68 24.52,49.68 29.79,54.94 | IDC1.2 73.23,47.96 v52.03,47.96
  Bottom 0.254: v45.1,46.9 50.97,46.9 v52.03,47.96
VCC  (via drill 0.35)
  Top 0.254: I2C_ADDRESS.1 44.98,56.17 47.14,54.01 47.14,48.03 C1.1
  Top 0.406: v45.41,52.01 45.41,49.05 42.77,46.41 40.64,46.41 IC1.28
  Top 1.016: IDC1.5 76.27,54.03 74.1,56.2 45.02,56.2 44.99,56.17 I2C_ADDRESS.1 I2C_ADDRESS.3 I2C_ADDRESS.5 I2C_ADDRESS.7 I2C_ADDRESS.9 I2C_ADDRESS.11 31.25,56.27 21.67,56.27 20.67,55.27 I2C_P/U.1 I2C_P/U.3 18.13,55.37 16.4,57.1 4.1,57.1 1.98,54.98 1.98,49.1 2.62,48.46 IDC2.5
  Bottom 0.254: 45.52,52.12 v45.41,52.01 | 44.09,56.16 I2C_ADDRESS.1
  Bottom 0.406: 45.52,52.12 45.52,54.74 44.09,56.16

### Text on the board
tPlace: PWM Lighting Controller 2021 | Austin's Creations | v0.3.1 | OE | EXT-CLK | VIN not used on IDC | VIN not used on IDC | GND | 1 | 2 | 3 | 4 | 5 | 6 | 7 | 8 | 9 | 10 | 11 | 12 | 13 | 14 | 15 | 16